# Altium schematic sheet SiAlarm_BlockDiagram.SchDoc
size D; SheetNumber: 7; SheetTotal: 7
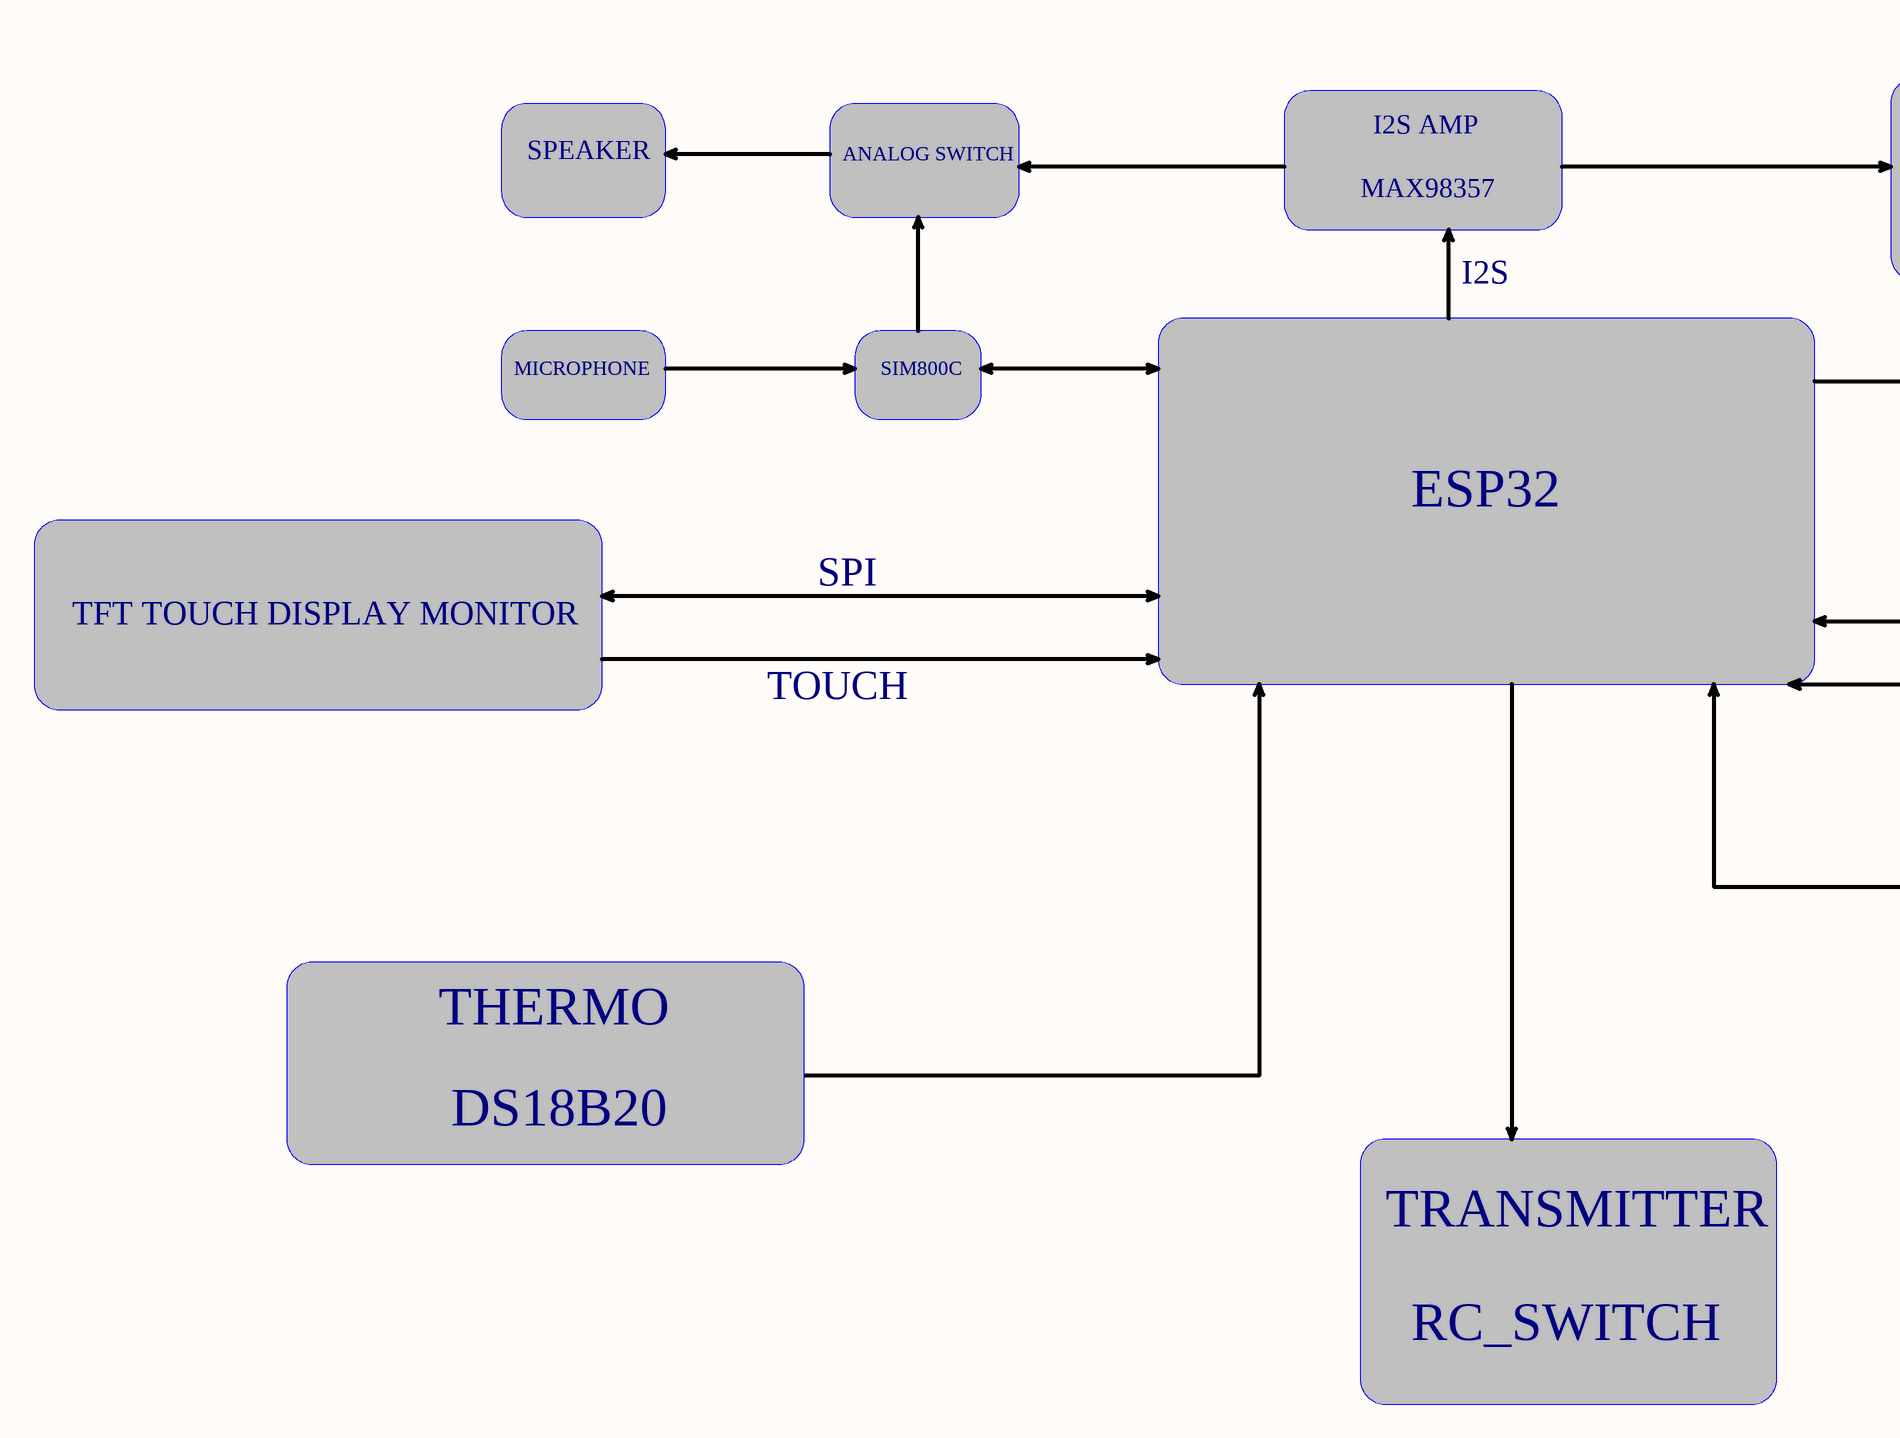
[diagram p0: SiAlarm_BlockDiagram.SchDoc, left]
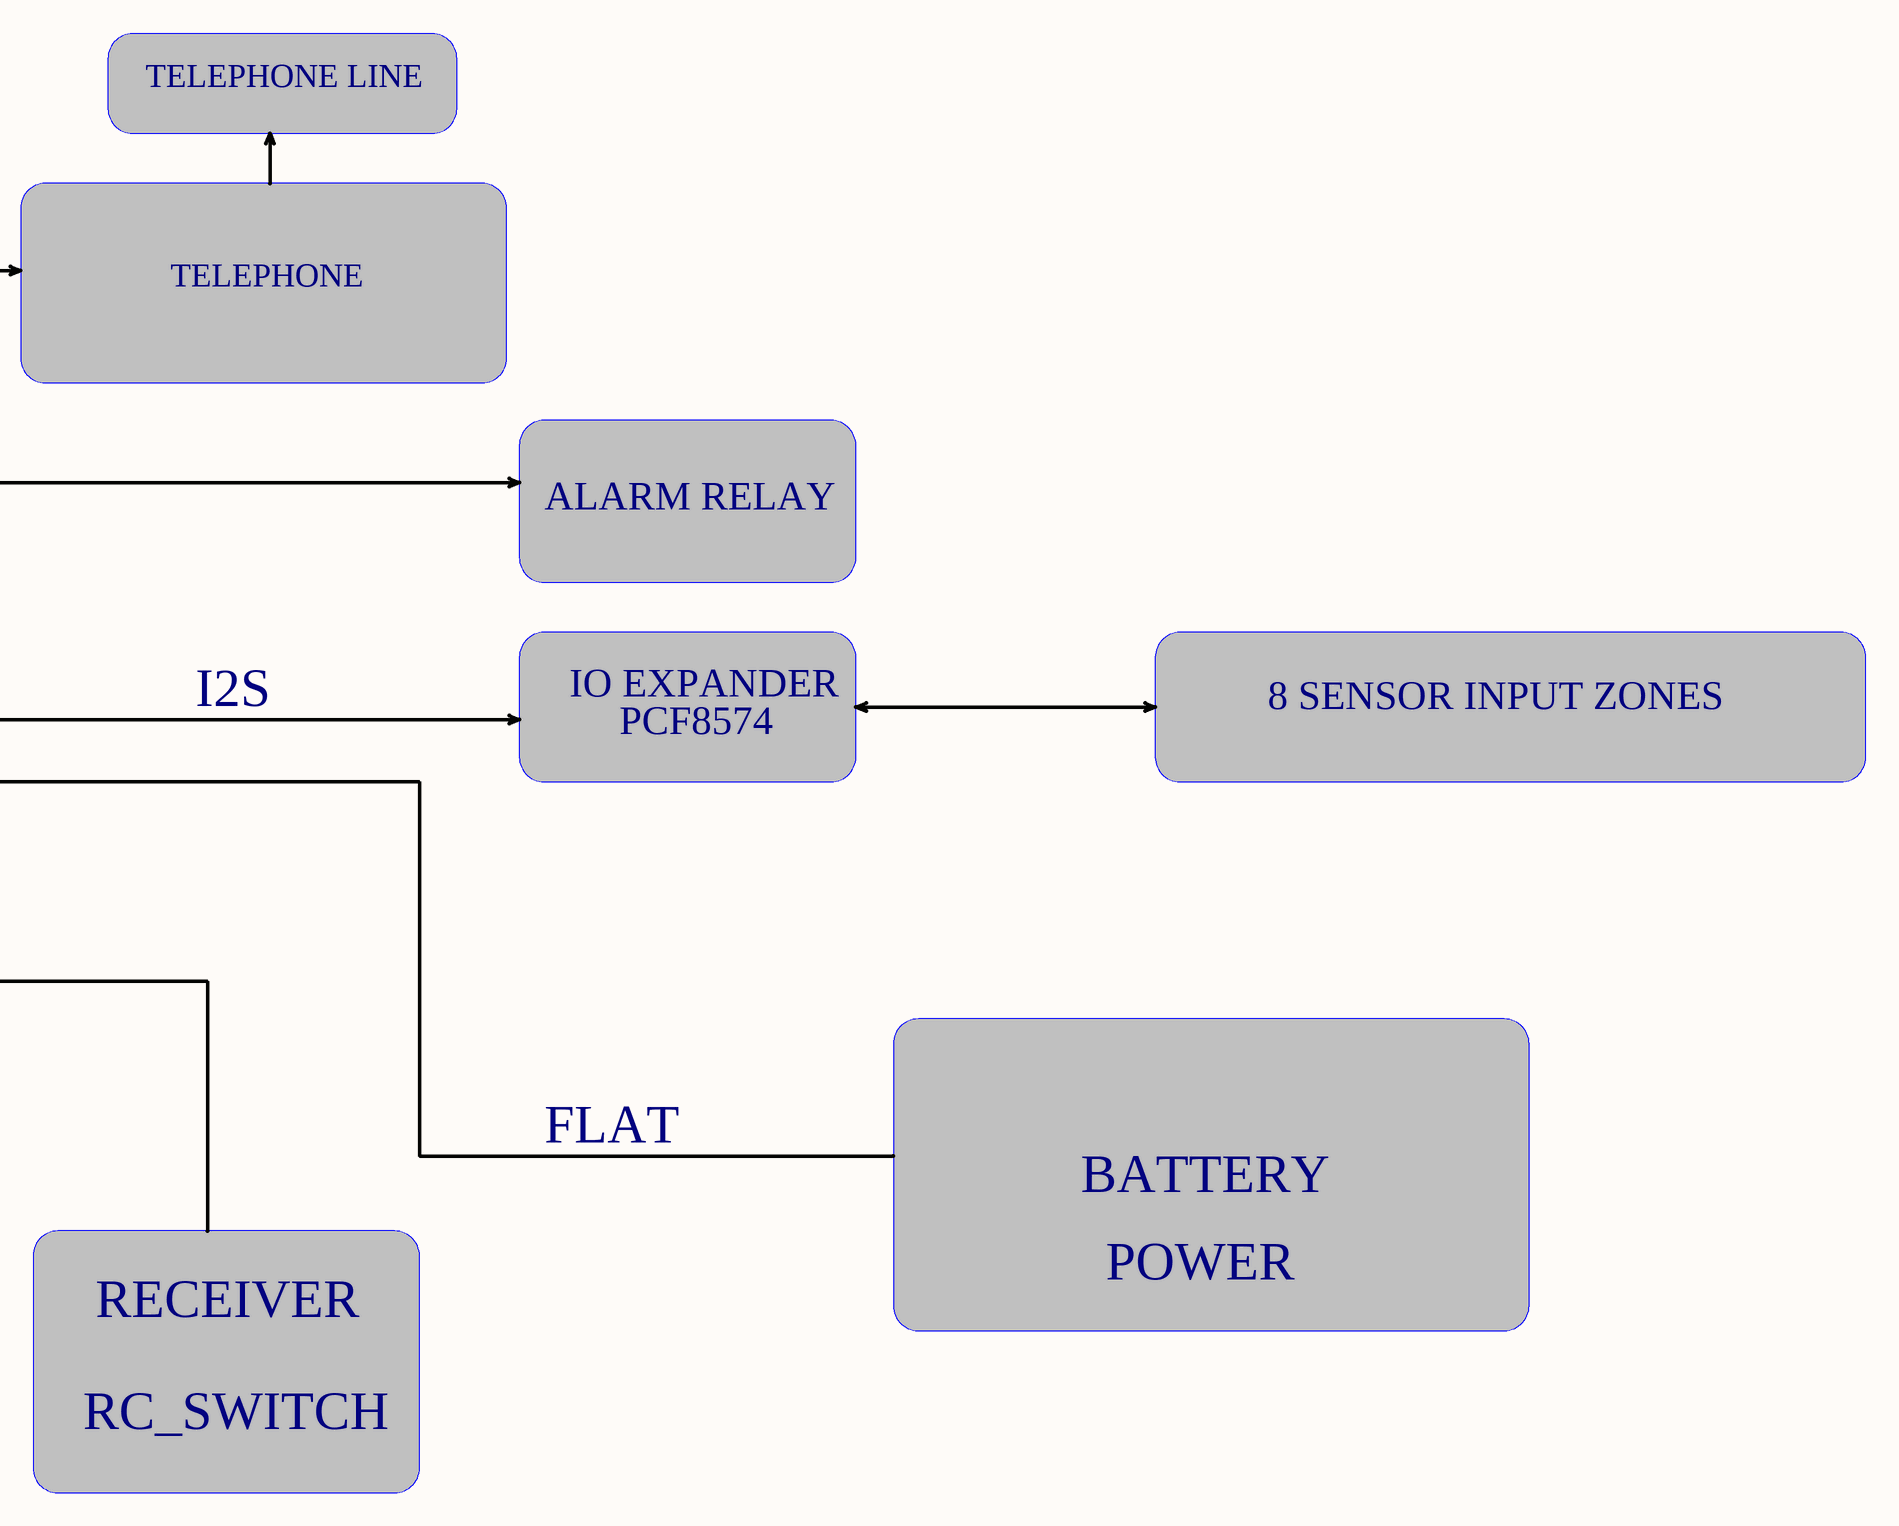
[diagram p1: SiAlarm_BlockDiagram.SchDoc, right]

## Notes on the sheet
- TELEPHONE LINE
- I2S AMP
- SPEAKER
- ANALOG SWITCH
- MAX98357
- TELEPHONE
- I2S
- MICROPHONE
- SIM800C
- ALARM RELAY
- ESP32
- TFT TOUCH DISPLAY MONITOR
- SPI
- IO EXPANDER
- PCF8574
- 8 SENSOR INPUT ZONES
- TOUCH
- THERMO
- FLAT
- DS18B20
- BATTERY
- POWER
- TRANSMITTER
- RECEIVER
- RC_SWITCH